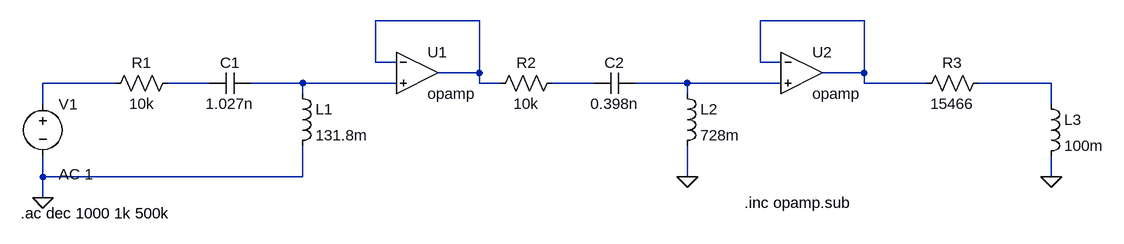
[diagram p0: schematic tp2_ej5.asc]
tp2_ej5.asc, the LTspice schematic file:
Version 4
SHEET 1 1380 680
WIRE 32 48 -128 48
WIRE 624 48 464 48
WIRE -128 112 -128 48
WIRE -96 112 -128 112
WIRE 464 112 464 48
WIRE 496 112 464 112
WIRE 32 128 32 48
WIRE 32 128 -32 128
WIRE 624 128 624 48
WIRE 624 128 560 128
WIRE -528 144 -640 144
WIRE -384 144 -448 144
WIRE -240 144 -320 144
WIRE -96 144 -240 144
WIRE 32 144 32 128
WIRE 64 144 32 144
WIRE 208 144 144 144
WIRE 352 144 272 144
WIRE 496 144 352 144
WIRE 624 144 624 128
WIRE 720 144 624 144
WIRE 912 144 800 144
WIRE -240 160 -240 144
WIRE 352 160 352 144
WIRE -640 176 -640 144
WIRE 912 176 912 144
WIRE -640 288 -640 256
WIRE -240 288 -240 240
WIRE -240 288 -640 288
WIRE 352 288 352 240
WIRE 912 288 912 256
WIRE -640 320 -640 288
FLAG -640 320 0
FLAG 352 288 0
FLAG 912 288 0
SYMBOL voltage -640 160 R0
WINDOW 123 24 124 Left 2
WINDOW 39 0 0 Left 0
SYMATTR InstName V1
SYMATTR Value ""
SYMATTR Value2 AC 1
SYMBOL res -432 128 R90
WINDOW 0 0 56 VBottom 2
WINDOW 3 32 56 VTop 2
SYMATTR InstName R1
SYMATTR Value 10k
SYMBOL ind -256 144 R0
SYMATTR InstName L1
SYMATTR Value 131.8m
SYMBOL cap -320 128 R90
WINDOW 0 0 32 VBottom 2
WINDOW 3 32 32 VTop 2
SYMATTR InstName C1
SYMATTR Value 1.027n
SYMBOL OpAmps\\opamp -64 64 R0
SYMATTR InstName U1
SYMBOL res 160 128 R90
WINDOW 0 0 56 VBottom 2
WINDOW 3 32 56 VTop 2
SYMATTR InstName R2
SYMATTR Value 10k
SYMBOL ind 336 144 R0
SYMATTR InstName L2
SYMATTR Value 728m
SYMBOL cap 272 128 R90
WINDOW 0 0 32 VBottom 2
WINDOW 3 32 32 VTop 2
SYMATTR InstName C2
SYMATTR Value 0.398n
SYMBOL OpAmps\\opamp 528 64 R0
SYMATTR InstName U2
SYMBOL ind 896 160 R0
SYMATTR InstName L3
SYMATTR Value 100m
SYMBOL res 816 128 R90
WINDOW 0 0 56 VBottom 2
WINDOW 3 32 56 VTop 2
SYMATTR InstName R3
SYMATTR Value 15466
TEXT -674 344 Left 2 !.ac dec 1000 1k 500k
TEXT 440 328 Left 2 !.inc opamp.sub

The netlist it stands for:
* tp2_ej5.asc
V1 N003 0 AC 1
R1 N004 N003 10k
L1 N005 0 131.8m
C1 N005 N004 1.027n
XU1 N001 N005 N001 opamp Aol=100K GBW=10Meg  ; pins invin noninvin out
R2 N006 N001 10k
L2 N007 0 728m
C2 N007 N006 0.398n
XU2 N002 N007 N002 opamp Aol=100K GBW=10Meg  ; pins invin noninvin out
L3 N008 0 100m
R3 N008 N002 15466
.ac dec 1000 1k 500k
.inc opamp.sub
.backanno
.end